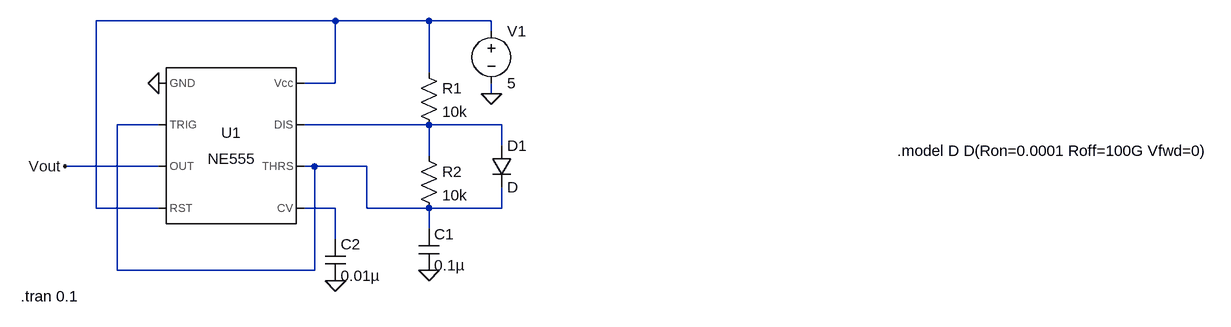
[diagram p0: schematic Symm.asc]
Symm.asc, the LTspice schematic file:
Version 4
SHEET 1 1764 680
WIRE 352 -32 -16 -32
WIRE 496 -32 352 -32
WIRE 592 -32 496 -32
WIRE 592 -16 592 -32
WIRE 496 48 496 -32
WIRE 352 64 352 -32
WIRE 352 64 304 64
WIRE 592 80 592 64
WIRE 80 128 16 128
WIRE 496 128 304 128
WIRE 608 128 496 128
WIRE 608 160 608 128
WIRE 496 176 496 128
WIRE 80 192 -64 192
WIRE 320 192 304 192
WIRE 400 192 320 192
WIRE -16 256 -16 -32
WIRE 80 256 -16 256
WIRE 352 256 304 256
WIRE 400 256 400 192
WIRE 496 256 400 256
WIRE 608 256 608 224
WIRE 608 256 496 256
WIRE 496 288 496 256
WIRE 352 304 352 256
WIRE 16 352 16 128
WIRE 320 352 320 192
WIRE 320 352 16 352
FLAG 80 64 0
FLAG 592 80 0
FLAG 352 368 0
FLAG 496 352 0
FLAG -64 192 Vout
SYMBOL Misc\\NE555 192 160 R0
SYMATTR InstName U1
SYMBOL voltage 592 -32 R0
SYMATTR InstName V1
SYMATTR Value 5
SYMBOL res 480 32 R0
SYMATTR InstName R1
SYMATTR Value 10k
SYMBOL res 480 160 R0
SYMATTR InstName R2
SYMATTR Value 10k
SYMBOL cap 480 288 R0
SYMATTR InstName C1
SYMATTR Value 0.1µ
SYMBOL cap 336 304 R0
SYMATTR InstName C2
SYMATTR Value 0.01µ
SYMBOL diode 592 160 R0
SYMATTR InstName D1
TEXT -132 392 Left 2 !.tran 0.1
TEXT 1216 168 Left 2 !.model D D(Ron=0.0001 Roff=100G Vfwd=0)

The netlist it stands for:
* Symm.asc
XU1 0 N002 Vout N001 N004 N002 N003 N001 NE555  ; pins GND TRIG OUT RST CV THRS DIS Vcc
V1 N001 0 5
R1 N001 N003 10k
R2 N003 N002 10k
C1 N002 0 0.1µ
C2 N004 0 0.01µ
D1 N003 N002 D
.model D D
.lib standard.dio
.tran 0.1
.model D D(Ron=0.0001 Roff=100G Vfwd=0)
.lib NE555.sub
.backanno
.end